# Altium project SFP_RFoF.PrjPcb (part 2 of 2)

## Sheet 08-RF_GPS.SchDoc
size C; SheetNumber: 8; SheetTotal: 12; SPICEModelCacheLBXRMXYW: <root> / <DocumentId>LBXRMXYW</DocumentId> / <CacheFrame Number="0"> / <Model Name="umk105bj104_v-f" Kind="CKT"> / <Text>* UMK105BJ104_V-F     SPICE MODEL  ( General Type ) / *-------------------------------------------------------------------------------------------------------- / * Model Generated by TAIYO YUDEN Corporation (http://www.ty-top.com) / * Version 1.0 / * TAIYO YUDEN Control No. 170508_120810 / * Copyright(c) 2012 TAIYO YUDEN CO.,LTD. All Rights Reserved. / *-------------------------------------------------------------------------------------------------------- / * / * Products Name : Multilayer Ceramic Capacitors / * / * Characteristics : / *     Capacitance : 0.1 uF , Rated Voltage : 50V , TCC : X5R / *     Case Size : 1.0 x 0.5 / 0.039 x 0.02 [mm/inch] , Thickness : 0.5 / 0.02 [mm/inch] / *     (Conditions: Temperature = 25 degC , DC Bias Current/Voltage = 0A / 0V) / * / * Frequency Range : 40Hz - 3GHz / * / * External Node Assignments : / * / *  1  o---| |---o  2 / * / *-------------------------------------------------------------------------------------------------------- / .SubCkt UMK105BJ104_V-F 1 2 / **************************** / C0 1 110 0.068998u / Cm 1 101 0.01292u / C1 101 102 0.041907u / Rc1 101 102 25.432k / C2 102 103 0.021417u / Rc2 102 103 1.1926k / C3 103 110 0.016759u / Rc3 103 110 12.415 / C2m 1 301 0.022631u / C21 301 302 0.1608u / Rc21 301 302 202.11k / C22 302 303 0.054305u / Rc22 302 303 87.274k / C23 303 304 0.14296u / Rc23 303 304 7.7387k / C24 304 305 0.08092u / Rc24 304 305 2.9339k / C25 305 306 0.04951u / Rc25 305 306 2.1733k / C26 306 307 0.043691u / Rc26 306 307 191.91 / C27 307 308 0.016759u / Rc27 307 308 147.23 / C28 308 309 5027.4p / Rc28 308 309 97.746 / C29 309 110 570.66p / Rc29 309 110 12.365 / Rp0 1 110 5G / L0 110 120 0.23341n / Lm 120 130 0.14222n / L1 120 121 0.036554n / RL1 121 130 1.698 / L2 120 122 0.11188n / RL2 122 130 0.33926 / L3 120 123 1.1401n / RL3 123 130 1.655 / CR 120 124 0.028892u / LR 124 125 0.10347n / RR 125 130 0.14446 / CL 130 140 2.048p / LL 130 140 0.1545n / RL 130 140 189.66 / Rs 140 2 26.069m / **************************** / .ends UMK105BJ104_V-F</Text> / </Model> / </CacheFrame> / </root>
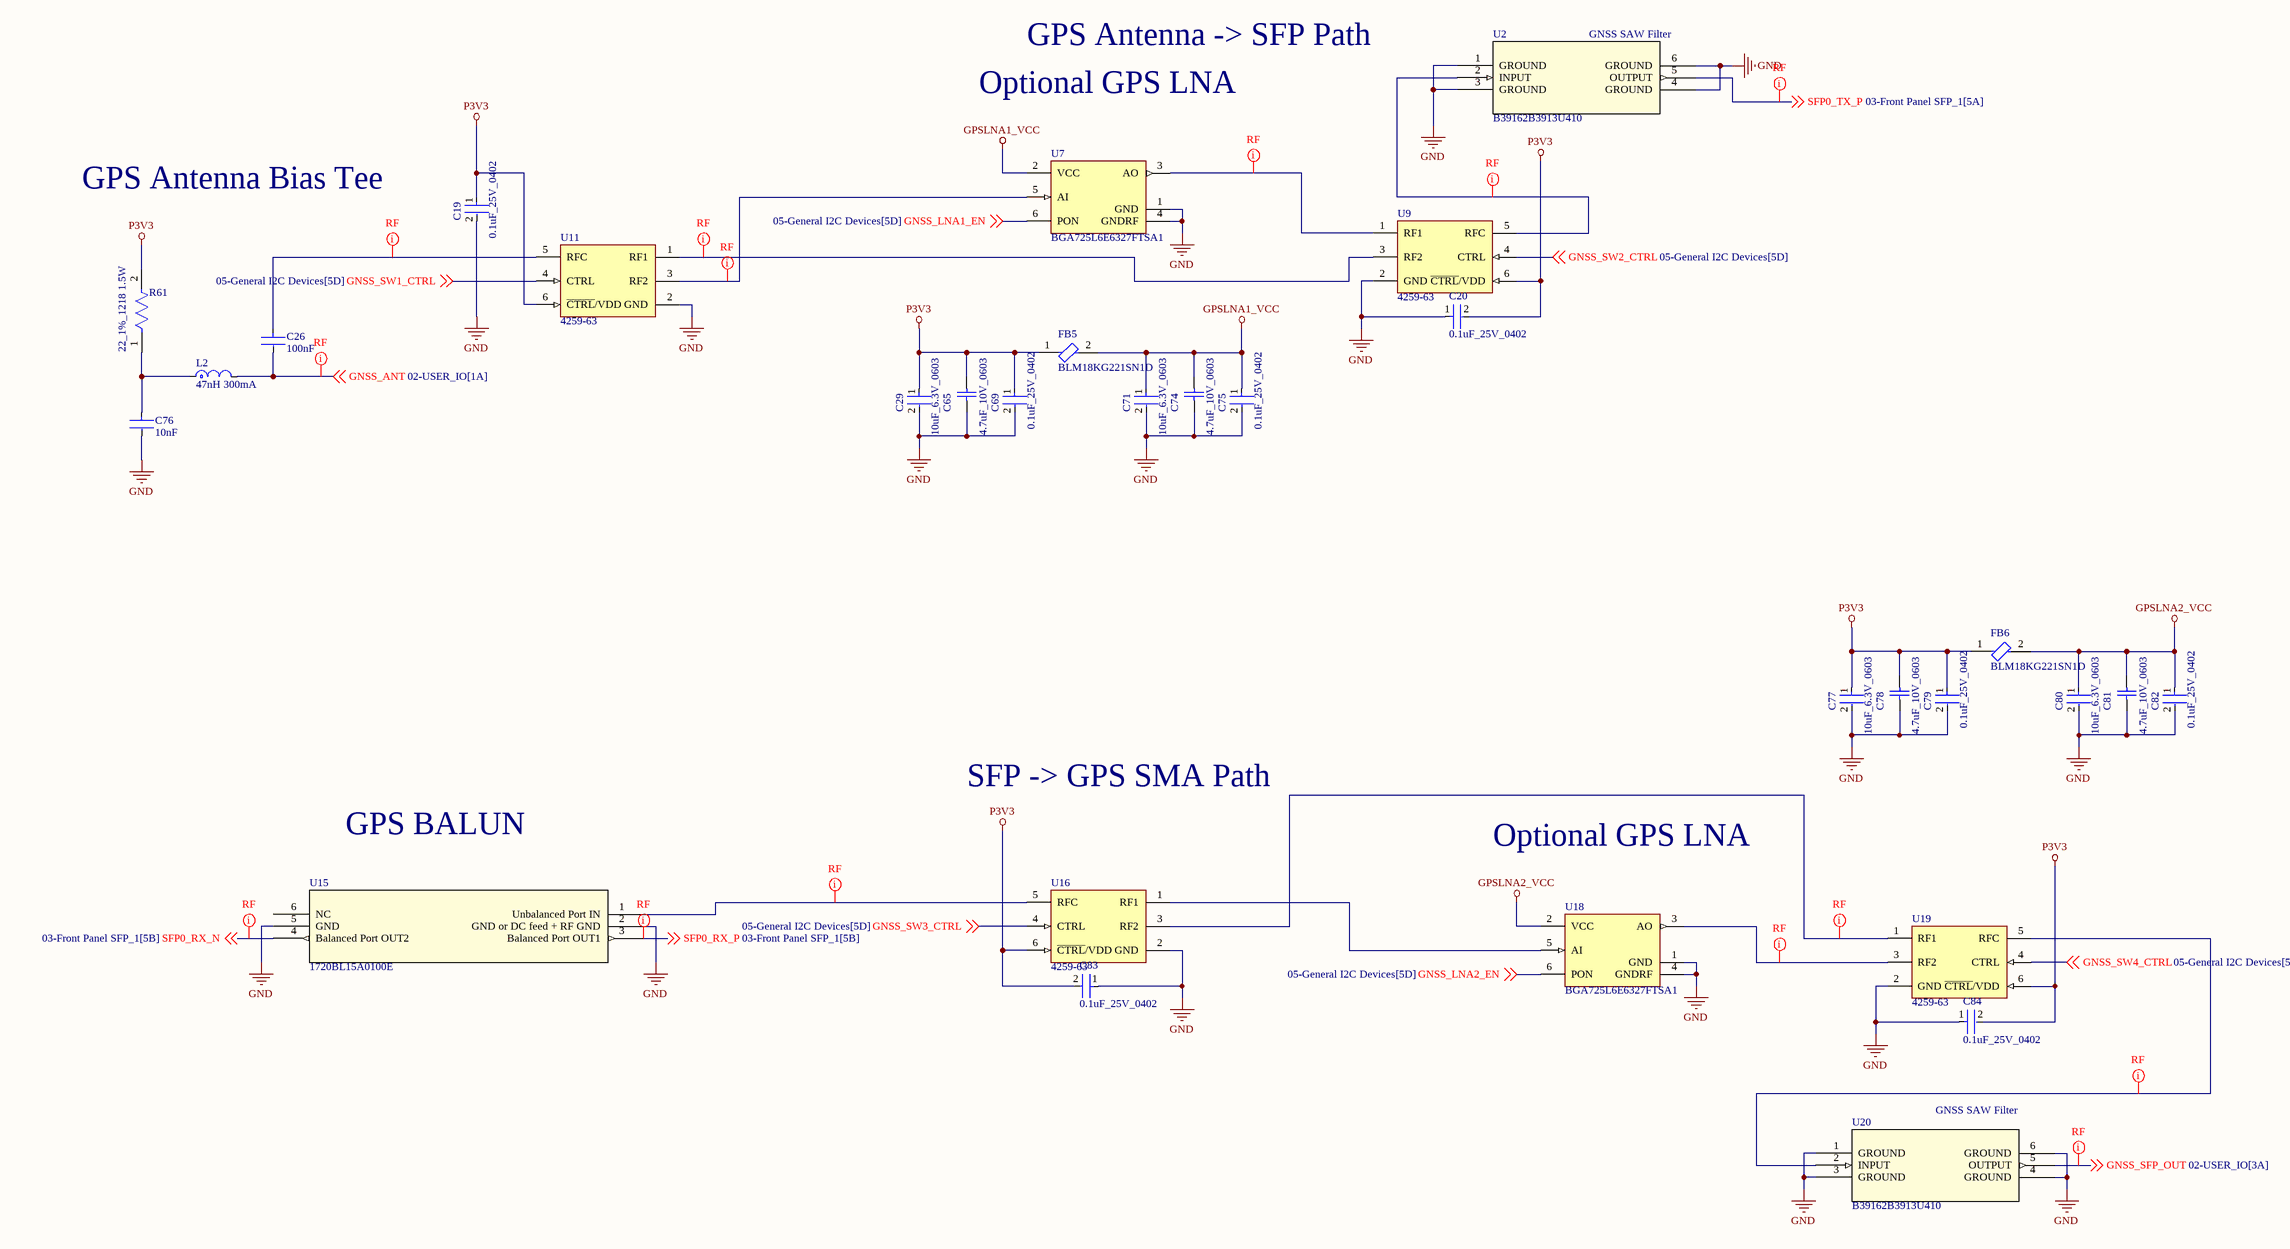
[diagram p5: 08-RF_GPS.SchDoc]

### Parts
C19  0.1uF_25V_0402  [FP-0402-L_1_0_1-W_0_5_0_1-IPC_C]
C20  0.1uF_25V_0402  [FP-0402-L_1_0_1-W_0_5_0_1-IPC_C]
C26  100nF  [FP-0402-L_1_0_0_05-W_0_5-IPC_B]
C29  10uF_6.3V_0603  [FP-C0603C106M9PACTU-MFG]
C65  4.7uF_10V_0603  [CAPC1608X87X35NL15T15]
C69  0.1uF_25V_0402  [FP-0402-L_1_0_1-W_0_5_0_1-IPC_C]
C71  10uF_6.3V_0603  [FP-C0603C106M9PACTU-MFG]
C74  4.7uF_10V_0603  [CAPC1608X87X35NL15T15]
C75  0.1uF_25V_0402  [FP-0402-L_1_0_1-W_0_5_0_1-IPC_C]
C76  10nF  [FP-GRM033-0_03-IPC_B]
C77  10uF_6.3V_0603  [FP-C0603C106M9PACTU-MFG]
C78  4.7uF_10V_0603  [CAPC1608X87X35NL15T15]
C79  0.1uF_25V_0402  [FP-0402-L_1_0_1-W_0_5_0_1-IPC_C]
C80  10uF_6.3V_0603  [FP-C0603C106M9PACTU-MFG]
C81  4.7uF_10V_0603  [CAPC1608X87X35NL15T15]
C82  0.1uF_25V_0402  [FP-0402-L_1_0_1-W_0_5_0_1-IPC_C]
C83  0.1uF_25V_0402  [FP-0402-L_1_0_1-W_0_5_0_1-IPC_C]
C84  0.1uF_25V_0402  [FP-0402-L_1_0_1-W_0_5_0_1-IPC_C]
FB5  BLM18KG221SN1D  [FP-BLM18-0_15-t0_8-IPC_B]
FB6  BLM18KG221SN1D  [FP-BLM18-0_15-t0_8-IPC_B]
L2  47nH 300mA  [FP-LQG15HH_02-IPC_B]
R61  22_1%_1218 1.5W  [FP-CRCW1218-HPe3-MFG]
U2  B39162B3913U410  [B39162B3913U410_QUA]
U7  BGA725L6E6327FTSA1  [FP-PG-TSLP-6-MFG]
U9  4259-63  [PERE-SC-70-6_M]
U11  4259-63  [PERE-SC-70-6_M]
U15  1720BL15A0100E  [SMT_15B0050E_JOT]
U16  4259-63  [PERE-SC-70-6_M]
U18  BGA725L6E6327FTSA1  [FP-PG-TSLP-6-MFG]
U19  4259-63  [PERE-SC-70-6_M]
U20  B39162B3913U410  [B39162B3913U410_QUA]

### Nets
GND: C19.2 C20.1 C29.2 C65.1 C69.2 C71.2 C74.1 C75.2 C76.2 C77.2 C78.1 C79.2 C80.2 C81.1 C82.2 C83.1 C84.1 U2.1(GROUND) U2.3(GROUND) U2.4(GROUND) U2.6(GROUND) U7.1(GND) U7.4(GNDRF) U9.2(GND) U11.2(GND) U15.2(GND_or_DC_feed_+_RF_GND) U15.5(GND) U16.2(GND) U18.1(GND) U18.4(GNDRF) U19.2(GND) U20.1(GROUND) U20.3(GROUND) U20.4(GROUND) U20.6(GROUND)
GPSLNA1_VCC: C71.1 C74.2 C75.1 FB5.2 U7.2(VCC)
GPSLNA2_VCC: C80.1 C81.2 C82.1 FB6.2 U18.2(VCC)
P3V3: C19.1 C20.2 C29.1 C65.2 C69.1 C77.1 C78.2 C79.1 C83.2 C84.2 FB5.1 FB6.1 R61.2 U9.6(~{CTRL}/VDD) U11.6(~{CTRL}/VDD) U16.6(~{CTRL}/VDD) U19.6(~{CTRL}/VDD)
GNSS_ANT: C26.2 L2.2 ; off-sheet GNSS_ANT
GNSS_LNA1_EN: U7.6(PON) ; off-sheet GNSS_LNA1_EN
GNSS_LNA2_EN: U18.6(PON) ; off-sheet GNSS_LNA2_EN
GNSS_SFP_OUT: U20.5(OUTPUT) ; off-sheet GNSS_SFP_OUT
GNSS_SW1_CTRL: U11.4(CTRL) ; off-sheet GNSS_SW1_CTRL
GNSS_SW2_CTRL: U9.4(CTRL) ; off-sheet GNSS_SW2_CTRL
GNSS_SW3_CTRL: U16.4(CTRL) ; off-sheet GNSS_SW3_CTRL
GNSS_SW4_CTRL: U19.4(CTRL) ; off-sheet GNSS_SW4_CTRL
SFP0_RX_N: U15.4(Balanced_Port_OUT2) ; off-sheet SFP0_RX_N
SFP0_RX_P: U15.3(Balanced_Port_OUT1) ; off-sheet SFP0_RX_P
SFP0_TX_P: U2.5(OUTPUT) ; off-sheet SFP0_TX_P
NetC26_1: C26.1 U11.5(RFC)
NetC76_1: C76.1 L2.1 R61.1
NetU2_2: U2.2(INPUT) U9.5(RFC)
NetU7_3: U7.3(AO) U9.1(RF1)
NetU7_5: U7.5(AI) U11.3(RF2)
NetU9_3: U9.3(RF2) U11.1(RF1)
NetU15_1: U15.1(Unbalanced_Port_IN) U16.5(RFC)
NetU16_1: U16.1(RF1) U18.5(AI)
NetU16_3: U16.3(RF2) U19.1(RF1)
NetU18_3: U18.3(AO) U19.3(RF2)
NetU19_5: U19.5(RFC) U20.2(INPUT)

Not connected (* = marked no-connect by the designer): U15 6(NC)

### Layout directives
net class RF: GNSS_ANT, GNSS_SFP_OUT, NetC26_1, NetU2_2, NetU7_3, NetU7_5, NetU9_3, NetU15_1, NetU16_3, NetU18_3, NetU19_5, SFP0_RX_N, SFP0_RX_P, SFP0_TX_P

### Notes on the sheet
- GPS Antenna -> SFP Path
- (near U2) GNSS SAW Filter
- Optional GPS LNA
- GPS Antenna Bias Tee
- GPS BALUN
- SFP -> GPS SMA Path
- (near U20) GNSS SAW Filter

### Library data of the parts
C19 C20 C69 C75 C79 C82-C84 = CMP-2008-02519-2: General Purpose Ceramic Capacitor, 0402, 100nF, 10%, X7R, 15%, 25V; Package Quantity: 1; Capacitance: 100nF; Min Operating Temperature: -55°C; Voltage: 25V; Voltage Rating: 25V; Construction: Flat; Max Operating Temperature: 125°C; Radiation Hardening: No; Depth: 0.5mm; Thickness: 0.022inch; Voltage Rating (DC): 25V; Number of Pins: 2; Lead Free: Lead Free; Series: -; REACH SVHC: No SVHC; Length: 1mm; Dielectric: X7R; RoHS Compliant: Yes; Mount: Surface Mount; Packaging: Tape and Reel; Case/Package: 0402; Case Code (Imperial): 0402; Termination: SMD/SMT; Width: 0.02inch; Case Code (Metric): 1005; Tolerance: 10%
C26 = CMP-14477-000330-2: None; Voltage Rating (DC): 50V; Dielectric: X5R; Tolerance: 10%; RoHS Compliant: Yes; Termination: SMD/SMT; Packaging: Tape and Reel; Capacitance: 100nF; Height: 0.5mm; Halogen Free: Halogen Free; Case Code (Metric): 1005; Width: 0.02inch; Max Operating Temperature: 85°C; Voltage Rating: 50V; Min Operating Temperature: -55°C; Package Quantity: 10000; Case/Package: 0402; Case Code (Imperial): 0402; Length: 0.039inch; Thickness: 0.022inch; Mount: Surface Mount
C29 C71 C77 C80 = CMP-2006-02285-3: CAP CER 10UF 6.3V X5R 0603; Manufacturer Part Number: C0603C106M9PACTU; Manufacturer: Kemet; Material: Ceramic; Temperature Coefficient: 15%; Tolerance: 20%; Category: Cap; Height: 0.9mm; Digikey Description: CAP CER 10UF 6.3V X5R 0603; Mouser Description: In a Pack of 10, KEMET 0603 (1608M) 10µF MLCC 6.3V dc ±20% SMD C0603C106M9PACTU; Voltage Rating: 6.3V; Device Class L2: Capacitors; Temperature Range Low: -55°C; Temperature Characteristic: X5R; ComponentLink2Description: Datasheet; Ipc Land Pattern Name: CAPC16080X80; ComponentLink2URL: http://www.kemet.com/Lists/ProductCatalog/Attachments/19/KEM_C1006_X5R_SMD.pdf; Capacitance: 10uF; Temperature Range High: +85°C; Device Class L3: Ceramic Capacitors; RoHS: TRUE; Automotive: No; Value: 10uF; Temperature: -55°C to +85°C; Device Class L1: Passive Components; Package: C0603C106M9PACTU; Lead Free: Yes; Octopart: https://octopart.com/c0603c106m9pactu-kemet-8375727
C65 C74 C78 C81 = CMP-2006-03238-1: Part Number: C0603C475K8PACTU; Manufacturer: Kemet
C76 = CMP-06035-000448-1: Chip Multilayer Ceramic Capacitors for General Purpose, 0201, 10000pF, X7R, 15%, 10%, 16V; Width: 300um; Tolerance: 10%; Capacitance: 10nF; Thickness: 300um; Dielectric: X7R; Voltage Rating (DC): 16V; Length: 600um
FB5 FB6 = CMP-0686-00556-7: Chip Ferrite Bead, 0603, 220Ω @ 100MHz, 0.05Ω, 25%, 2.2A; DC Resistance (DCR): 50mR; Number of Circuits: 1; Impedance: 220R; Current Rating: 2.2A; Material: Ferrite; Test Frequency: 100MHz; Depth: 0.8mm; Series: BLM18K; RoHS Compliant: Yes; Termination: SMD/SMT; Max Current Rating: 2.2A; Case Code (Metric): 1608; Radiation Hardening: No; Number of Pins: 2; Length: 1.6mm; Lead Free: Lead Free; Package Quantity: 1; Height: 0.8mm; Core Material: Ferrite; Inductor Type: FERRITE BEAD; Min Operating Temperature: -55°C; Case/Package: 0603; Case Code (Imperial): 0603; Number of Lines: 1; Packaging: Tape and Reel; REACH SVHC: No SVHC; Max Operating Temperature: 125°C; Military Standard: Not; DC Resistance-Max: 50mR; Width: 0.8mm; DC Current: 2.2A; Max DC Current: 2.2A; Tolerance: 25%; Weight: 7.1E-05oz
L2 = CMP-06042-015783-1: Multilayer type RF Inductor 47nH ±5% 0.72Ω 300mA 0402; Core Material: Air; DC Resistance (DCR): 720mR; DC Current: 200mA; Shielding: Unshielded; Self Resonant Frequency: 1GHz; Q Factor: 8; Test Frequency: 100MHz; Tolerance: 5%; Packaging: Tape and Reel; Case Code (Imperial): 0402; Max Operating Temperature: 125°C; Military Standard: Not; Length: 1mm; Radiation Hardening: No; Height: 0.5mm; Min Operating Temperature: -55°C; Width: 0.02inch; Inductance: 47nH; Lead Free: Lead Free; Termination: SMD/SMT; Height - Seated (Max): 0.022inch; Rated Current-Max: 200mA; Case/Package: 0402; Max DC Current: 200mA; Series: LQG15HS; Case Code (Metric): 1005; Mount: Surface Mount; Current Rating: 200mA; Depth: 0.55mm; Package Quantity: 1
R61 = CMP-02407-011337-1: RES Thick Film, 22.6Ω, 1%, 1.5W, 100ppm/°C, 1218; Resistance: 22.6R; Temperature Coefficient: 100ppm/°C; Min Operating Temperature: -55°C; Number of Terminations: 2; Length: 0.122inch; Max Operating Temperature: 155°C; Packaging: Tape and Reel; Case/Package: 1218; Height: 0.028inch; RoHS Compliant: Yes; Tolerance: 1%; Width: 0.181inch; Package Quantity: 4000; Resistor Type: Thick Film; Features: Automotive AEC-Q200; Lead Free: Lead Free; Max Power Dissipation: 1.5W
U2 U20 = B39162B3913U410: No Description Available; Mfr_Name: Qualcomm; RefDes: RefDes; Type: Type
U7 U18 = CMP-32860-000003-1: IC AMP GPS 1.55-1.615GHZ TSLP6-2; Manufacturer: Infineon; Max Power Dissipation: 72mW; Noise Figure: 0.65dB; Gain: 20dB; Max Junction Temp: +150°C; Nominal Supply Current: 3.6mA; Max Supply Voltage: 3.6V; Min Supply Voltage: 1.5V; Max Frequency: 1615MHz; Bandwidth: 65MHz; RoHS: TRUE; Device Class L1: Integrated Circuits (ICs); Manufacturer Part Number: BGA725L6E6327FTSA1; Octopart: https://octopart.com/bga725l6e6327ftsa1-infineon-23421878; Temperature Range High: +150°C; Temperature: to +150°C; ComponentLink2URL: https://www.infineon.com/dgdl/Infineon-BGA725L6-DS-v02_00-en.pdf?fileId=db3a30433784a0400137ef9a4d341f23; Device Class L2: RF Semiconductors and Devices; Ambient Temperature Range Low: -40°C; Device Class L3: RF Amplifiers; ComponentLink2Description: Datasheet; Mouser Description: RF Amp Chip Single Low Noise Amplifier 1615MHz 3.6V 6-Pin TSLP T/R; Digikey Description: IC AMP GPS 1.55-1.615GHZ TSLP6-2; Package: PG-TSLP-6; Ambient Temperature Range High: +85°C; Footprint Url: https://www.infineon.com/cms/en/product/packages/PG-TSLP/PG-TSLP-6-2/; Category: IC; Lead Free: Yes; Height: 0.4mm; Automotive: No
U9 U11 U16 U19 = CMP-2000-05298-1: IC RF Switch SPDT, 50 Ohm, 6-Pin SC70, RoHS, Tape and Reel; Manufacturer: Peregrine Semiconductor; P1dB: 29dBm(typ)IP1dB; Topology: Reflective; Frequency - Upper: 3GHz; Insertion Loss @ Frequency: 0.5dB@2GHz; IIP3: 55dBm(typ); Voltage - Supply: 1.8V~3.3V; Other Names: 1046-1011-24259-63-ND425963PE4259PE4259SCBC-ZPE4259SCBC-Z-ND; Isolation @ Frequency: 20dB@2GHz(typ); Frequency - Lower: 10MHz; Online Catalog: PE4259; Impedance: 50Ohm; RF Type: GeneralPurpose; Series: UltraCMOS; Manufacturer URL: http://www.psemi.com/; Package Description: 6-Pin Small Outline Transistor, Body 2.05 x 1.25 mm, Pitch 0.65 mm; Family: RFSwitches; Packaging: Tape&Reel(TR); Features: Single/DualLineControl; Package / Case: 6-TSSOP,SC-88,SOT-363; Operating Temperature: -40degC~85degC; Circuit: SPDT; Supplier Device Package: SC-70-6; Standard Package: 3,000; Datasheet URL: https://datasheet.ciiva.com/15100/getdatasheetpartid-685660-15100501.pdf; Category: RF/IFandRFID; Datasheet Version: Jan-11; Package Reference: SC-70-6
U15 = 1720BL15A0100E: No Description Available; Mfr_Name: Johanson Technology; RefDes: RefDes; Type: Type

## Sheet 09-RF_SUBG.SchDoc
size C; SheetNumber: 9; SheetTotal: 12; SPICEModelCacheYEUHMWUF: <root> / <DocumentId>YEUHMWUF</DocumentId> / <CacheFrame Number="0"> / <Model Name="umk105bj104_v-f" Kind="CKT"> / <Text>* UMK105BJ104_V-F     SPICE MODEL  ( General Type ) / *-------------------------------------------------------------------------------------------------------- / * Model Generated by TAIYO YUDEN Corporation (http://www.ty-top.com) / * Version 1.0 / * TAIYO YUDEN Control No. 170508_120810 / * Copyright(c) 2012 TAIYO YUDEN CO.,LTD. All Rights Reserved. / *-------------------------------------------------------------------------------------------------------- / * / * Products Name : Multilayer Ceramic Capacitors / * / * Characteristics : / *     Capacitance : 0.1 uF , Rated Voltage : 50V , TCC : X5R / *     Case Size : 1.0 x 0.5 / 0.039 x 0.02 [mm/inch] , Thickness : 0.5 / 0.02 [mm/inch] / *     (Conditions: Temperature = 25 degC , DC Bias Current/Voltage = 0A / 0V) / * / * Frequency Range : 40Hz - 3GHz / * / * External Node Assignments : / * / *  1  o---| |---o  2 / * / *-------------------------------------------------------------------------------------------------------- / .SubCkt UMK105BJ104_V-F 1 2 / **************************** / C0 1 110 0.068998u / Cm 1 101 0.01292u / C1 101 102 0.041907u / Rc1 101 102 25.432k / C2 102 103 0.021417u / Rc2 102 103 1.1926k / C3 103 110 0.016759u / Rc3 103 110 12.415 / C2m 1 301 0.022631u / C21 301 302 0.1608u / Rc21 301 302 202.11k / C22 302 303 0.054305u / Rc22 302 303 87.274k / C23 303 304 0.14296u / Rc23 303 304 7.7387k / C24 304 305 0.08092u / Rc24 304 305 2.9339k / C25 305 306 0.04951u / Rc25 305 306 2.1733k / C26 306 307 0.043691u / Rc26 306 307 191.91 / C27 307 308 0.016759u / Rc27 307 308 147.23 / C28 308 309 5027.4p / Rc28 308 309 97.746 / C29 309 110 570.66p / Rc29 309 110 12.365 / Rp0 1 110 5G / L0 110 120 0.23341n / Lm 120 130 0.14222n / L1 120 121 0.036554n / RL1 121 130 1.698 / L2 120 122 0.11188n / RL2 122 130 0.33926 / L3 120 123 1.1401n / RL3 123 130 1.655 / CR 120 124 0.028892u / LR 124 125 0.10347n / RR 125 130 0.14446 / CL 130 140 2.048p / LL 130 140 0.1545n / RL 130 140 189.66 / Rs 140 2 26.069m / **************************** / .ends UMK105BJ104_V-F</Text> / </Model> / </CacheFrame> / </root>
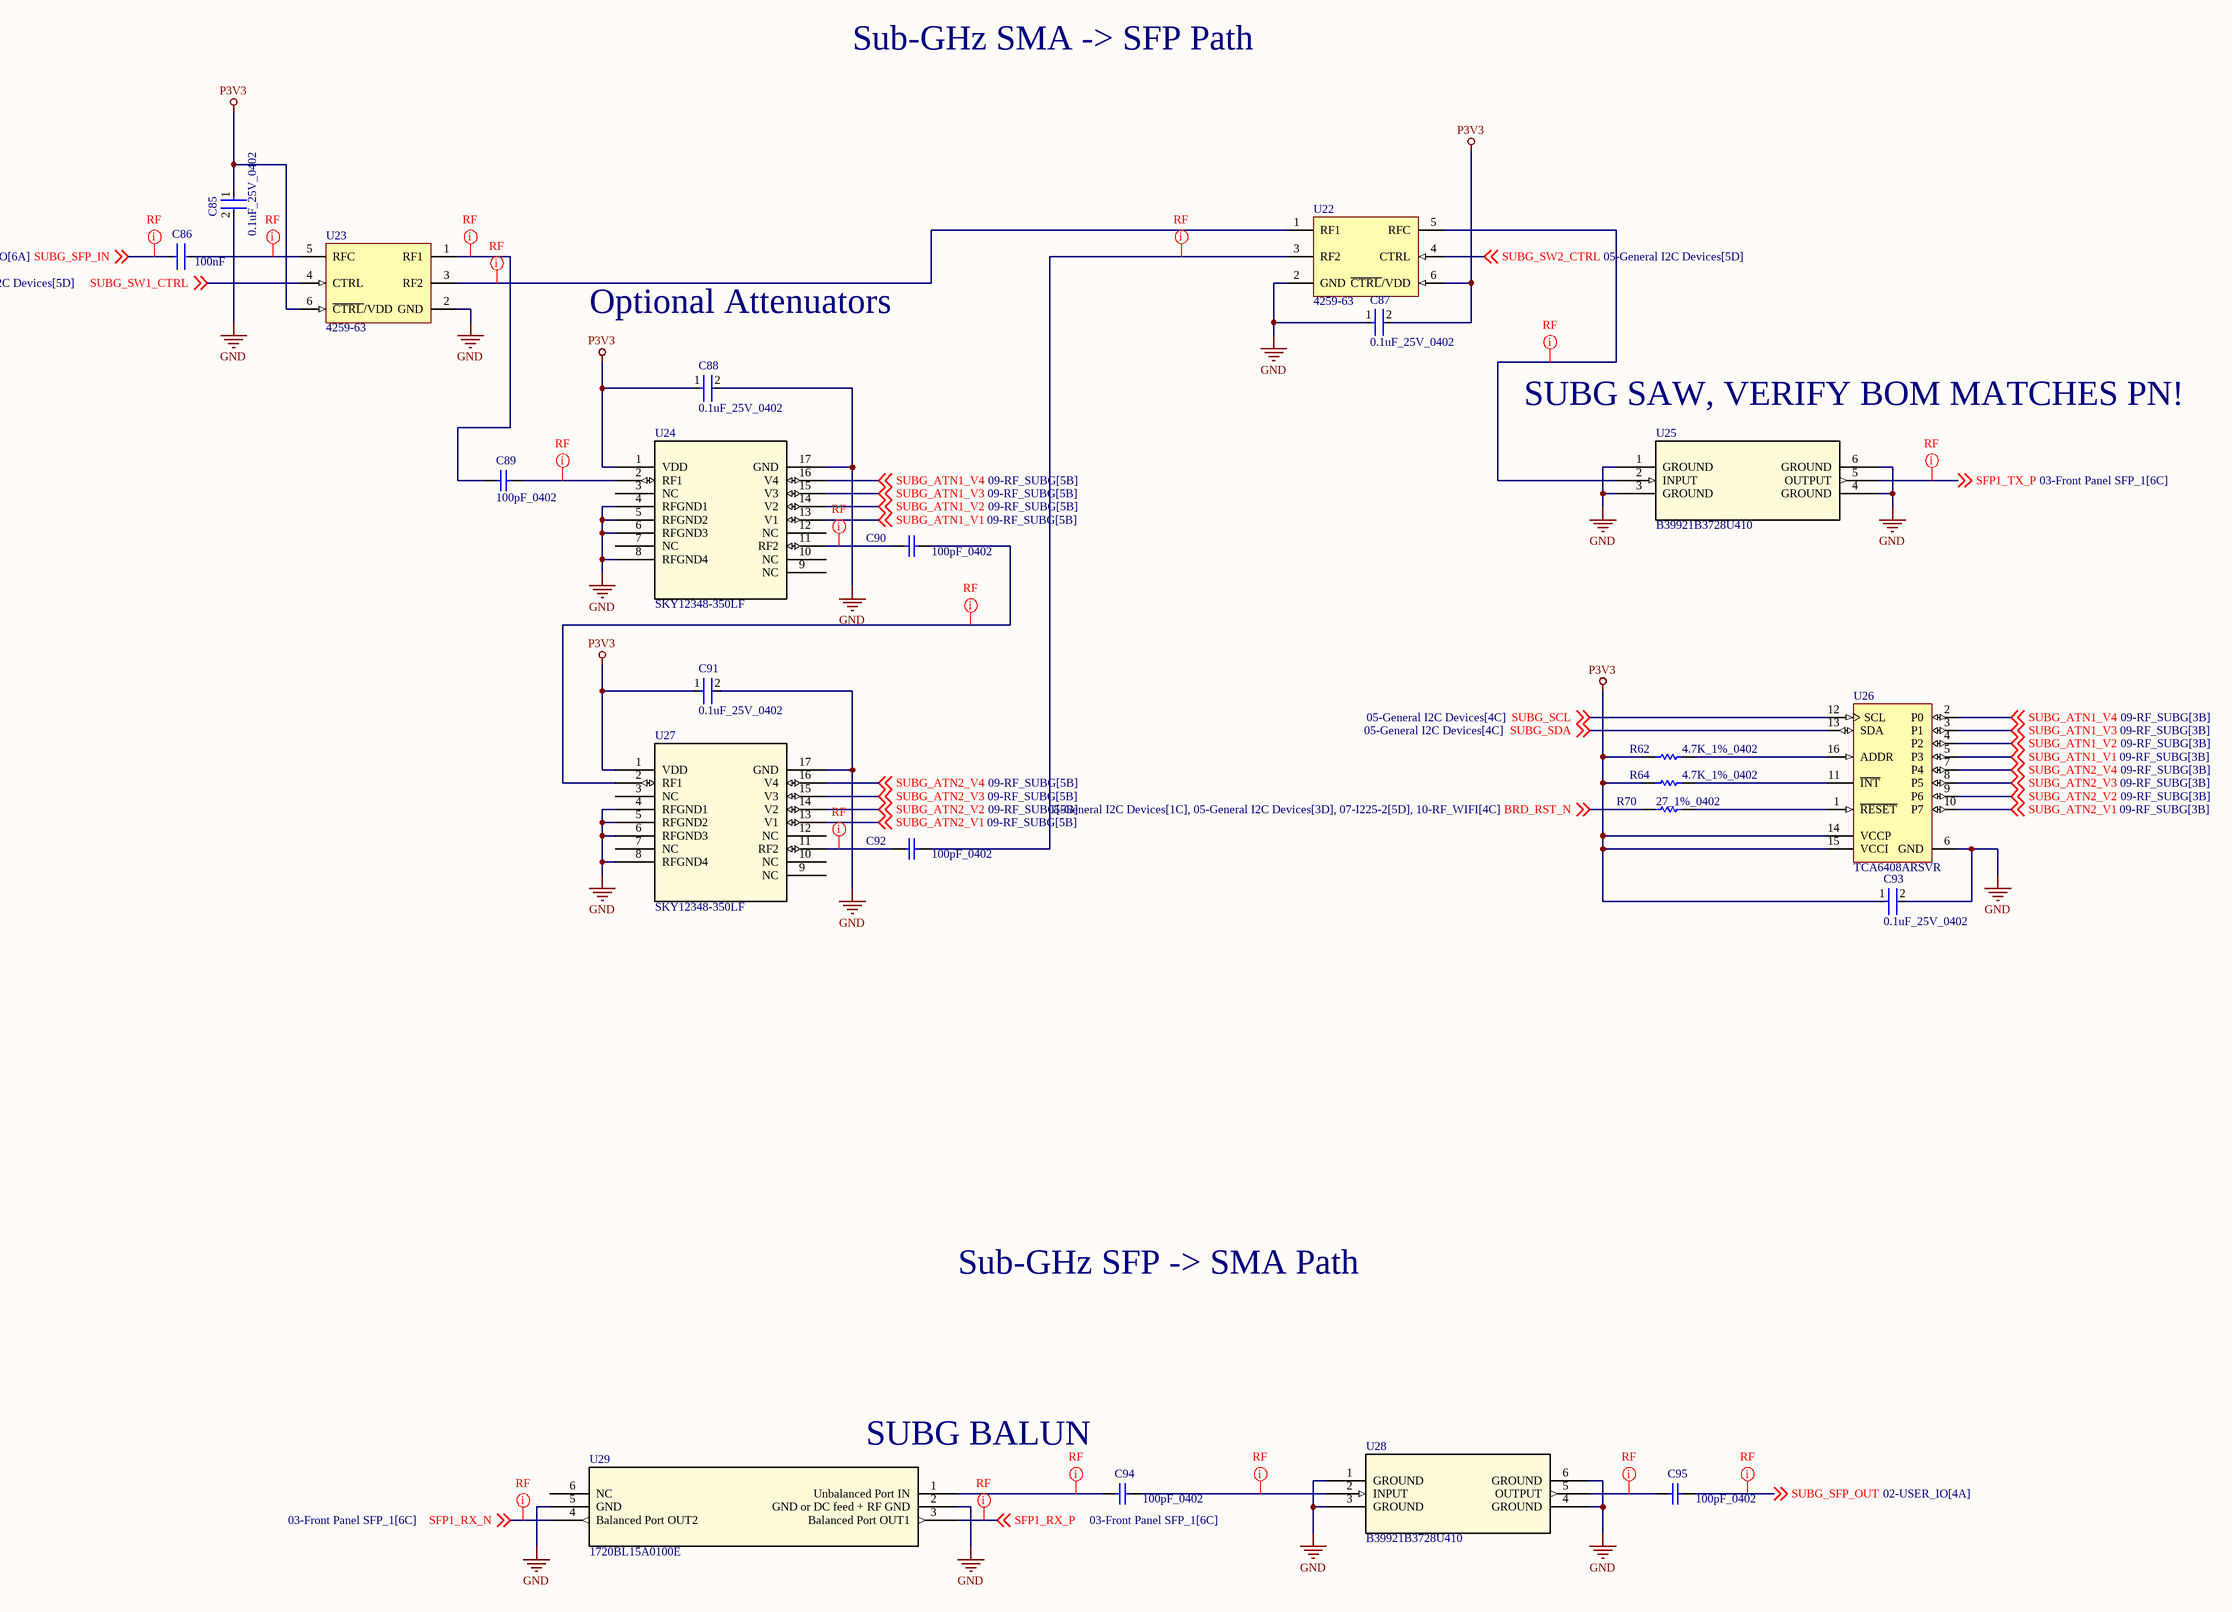
[diagram p6: 09-RF_SUBG.SchDoc]

### Parts
C85  0.1uF_25V_0402  [FP-0402-L_1_0_1-W_0_5_0_1-IPC_C]
C86  100nF  [FP-0402-L_1_0_0_05-W_0_5-IPC_B]
C87  0.1uF_25V_0402  [FP-0402-L_1_0_1-W_0_5_0_1-IPC_C]
C88  0.1uF_25V_0402  [FP-0402-L_1_0_1-W_0_5_0_1-IPC_C]
C89  100pF_0402  [CAPC1005X55X25ML05T10]
C90  100pF_0402  [CAPC1005X55X25ML05T10]
C91  0.1uF_25V_0402  [FP-0402-L_1_0_1-W_0_5_0_1-IPC_C]
C92  100pF_0402  [CAPC1005X55X25ML05T10]
C93  0.1uF_25V_0402  [FP-0402-L_1_0_1-W_0_5_0_1-IPC_C]
C94  100pF_0402  [CAPC1005X55X25ML05T10]
C95  100pF_0402  [CAPC1005X55X25ML05T10]
R62  4.7K_1%_0402  [RESC1005X40X25NL10T10]
R64  4.7K_1%_0402  [RESC1005X40X25NL10T10]
R70  27_1%_0402  [RESC1005X40X25NL05T05]
U22  4259-63  [PERE-SC-70-6_M]
U23  4259-63  [PERE-SC-70-6_M]
U24  SKY12348-350LF  [SKY12348-350LF_SKY]
U25  B39921B3728U410  [B39162B3913U410_QUA]
U26  TCA6408ARSVR  [RSV0016A_V]
U27  SKY12348-350LF  [SKY12348-350LF_SKY]
U28  B39921B3728U410  [B39162B3913U410_QUA]
U29  1720BL15A0100E  [SMT_15B0050E_JOT]

### Nets
GND: C85.2 C87.1 C88.2 C91.2 C93.2 U22.2(GND) U23.2(GND) U24.4(RFGND1) U24.5(RFGND2) U24.6(RFGND3) U24.8(RFGND4) U24.17(GND) U25.1(GROUND) U25.3(GROUND) U25.4(GROUND) U25.6(GROUND) U26.6(GND) U27.4(RFGND1) U27.5(RFGND2) U27.6(RFGND3) U27.8(RFGND4) U27.17(GND) U28.1(GROUND) U28.3(GROUND) U28.4(GROUND) U28.6(GROUND) U29.2(GND_or_DC_feed_+_RF_GND) U29.5(GND)
P3V3: C85.1 C87.2 C88.1 C91.1 C93.1 R62.2 R64.2 U22.6(~{CTRL}/VDD) U23.6(~{CTRL}/VDD) U24.1(VDD) U26.14(VCCP) U26.15(VCCI) U27.1(VDD)
BRD_RST_N: R70.1 ; off-sheet BRD_RST_N
SFP1_RX_N: U29.4(Balanced_Port_OUT2) ; off-sheet SFP1_RX_N
SFP1_RX_P: U29.3(Balanced_Port_OUT1) ; off-sheet SFP1_RX_P
SFP1_TX_P: U25.5(OUTPUT) ; off-sheet SFP1_TX_P
SUBG_ATN1_V1: U24.13(V1) U26.5(P3) ; off-sheet SUBG_ATN1_V1
SUBG_ATN1_V2: U24.14(V2) U26.4(P2) ; off-sheet SUBG_ATN1_V2
SUBG_ATN1_V3: U24.15(V3) U26.3(P1) ; off-sheet SUBG_ATN1_V3
SUBG_ATN1_V4: U24.16(V4) U26.2(P0) ; off-sheet SUBG_ATN1_V4
SUBG_ATN2_V1: U26.10(P7) U27.13(V1) ; off-sheet SUBG_ATN2_V1
SUBG_ATN2_V2: U26.9(P6) U27.14(V2) ; off-sheet SUBG_ATN2_V2
SUBG_ATN2_V3: U26.8(P5) U27.15(V3) ; off-sheet SUBG_ATN2_V3
SUBG_ATN2_V4: U26.7(P4) U27.16(V4) ; off-sheet SUBG_ATN2_V4
SUBG_SCL: U26.12(SCL) ; off-sheet SUBG_SCL
SUBG_SDA: U26.13(SDA) ; off-sheet SUBG_SDA
SUBG_SFP_IN: C86.1 ; off-sheet SUBG_SFP_IN
SUBG_SFP_OUT: C95.2 ; off-sheet SUBG_SFP_OUT
SUBG_SW1_CTRL: U23.4(CTRL) ; off-sheet SUBG_SW1_CTRL
SUBG_SW2_CTRL: U22.4(CTRL) ; off-sheet SUBG_SW2_CTRL
NetC86_2: C86.2 U23.5(RFC)
NetC89_1: C89.1 U23.1(RF1)
NetC89_2: C89.2 U24.2(RF1)
NetC90_1: C90.1 U24.11(RF2)
NetC90_2: C90.2 U27.2(RF1)
NetC92_1: C92.1 U27.11(RF2)
NetC92_2: C92.2 U22.3(RF2)
NetC94_1: C94.1 U29.1(Unbalanced_Port_IN)
NetC94_2: C94.2 U28.2(INPUT)
NetC95_1: C95.1 U28.5(OUTPUT)
NetR62_1: R62.1 U26.16(ADDR)
NetR64_1: R64.1 U26.11(~{INT})
NetR70_2: R70.2 U26.1(~{RESET})
NetU22_1: U22.1(RF1) U23.3(RF2)
NetU22_5: U22.5(RFC) U25.2(INPUT)

Not connected (* = marked no-connect by the designer): U24 3(NC) 7(NC) 9(NC) 10(NC) 12(NC); U27 3(NC) 7(NC) 9(NC) 10(NC) 12(NC); U29 6(NC)

### Layout directives
net class RF: NetC86_2, NetC89_1, NetC89_2, NetC90_1, NetC90_2, NetC92_1, NetC92_2, NetC94_1, NetC94_2, NetC95_1, NetU22_1, NetU22_5, SFP1_RX_N, SFP1_RX_P, SFP1_TX_P, SUBG_SFP_IN, SUBG_SFP_OUT

### Notes on the sheet
- Sub-GHz SMA -> SFP Path
- Optional Attenuators
- SUBG SAW, VERIFY BOM MATCHES PN!
- Sub-GHz SFP -> SMA Path
- (near U29) SUBG BALUN

### Library data of the parts
C85 C87 C88 C91 C93 = CMP-2008-02519-2: as C19 on sheet 08-RF_GPS; Package Quantity: 1; Capacitance: 100nF; Min Operating Temperature: -55°C; Voltage: 25V; Voltage Rating: 25V; Construction: Flat; Max Operating Temperature: 125°C; Radiation Hardening: No; Depth: 0.5mm; Thickness: 0.022inch; Voltage Rating (DC): 25V; Number of Pins: 2; Lead Free: Lead Free; Series: -; REACH SVHC: No SVHC; Length: 1mm; Dielectric: X7R; RoHS Compliant: Yes; Mount: Surface Mount; Packaging: Tape and Reel; Case/Package: 0402; Case Code (Imperial): 0402; Termination: SMD/SMT; Width: 0.02inch; Case Code (Metric): 1005; Tolerance: 10%
C86 = CMP-14477-000330-2: as C26 on sheet 08-RF_GPS; RoHS Compliant: Yes; Termination: SMD/SMT; Packaging: Tape and Reel; Capacitance: 100nF; Height: 0.5mm; Halogen Free: Halogen Free; Case Code (Metric): 1005; Width: 0.02inch; Max Operating Temperature: 85°C; Voltage Rating: 50V; Min Operating Temperature: -55°C; Package Quantity: 10000; Case/Package: 0402; Case Code (Imperial): 0402; Length: 0.039inch; Thickness: 0.022inch; Mount: Surface Mount
C89 C90 C92 C94 C95 = CMP-2008-03915-1: Manufacturer: Murata; Part Number: GRM1555C1H101JA01D
R62 R64 = CMP-2002-05217-1: Manufacturer: Bourns; Part Number: CR0402-FX-4701GLF
R70 = CMP-2002-08434-1: Part Number: CRCW040227R0FKED; Manufacturer: Vishay Dale
U22 U23 = CMP-2000-05298-1: as U9 on sheet 08-RF_GPS; Series: UltraCMOS; Manufacturer URL: http://www.psemi.com/; Package Description: 6-Pin Small Outline Transistor, Body 2.05 x 1.25 mm, Pitch 0.65 mm; Family: RFSwitches; Packaging: Tape&Reel(TR); Features: Single/DualLineControl; Package / Case: 6-TSSOP,SC-88,SOT-363; Operating Temperature: -40degC~85degC; Circuit: SPDT; Supplier Device Package: SC-70-6; Standard Package: 3,000; Datasheet URL: https://datasheet.ciiva.com/15100/getdatasheetpartid-685660-15100501.pdf; Category: RF/IFandRFID; Datasheet Version: Jan-11; Package Reference: SC-70-6
U24 U27 = SKY12348-350LF: No Description Available; Mfr_Name: Skyworks; RefDes: RefDes; Type: Type
U25 U28 = B39162B3913U410: as U2 on sheet 08-RF_GPS; RefDes: RefDes; Type: Type
U26 = CMP-0314-00021-2: Low-Voltage 8-Bit I2C and SMBus I/O Expander, 1.65 to 5.5 V, -40 to 85 degC, 16-pin UQFN (RSV), Green (RoHS & no Sb/Br); Manufacturer: Texas Instruments; Configuration Registers: Yes; Max Frequency(kHz): 400; # of I/Os: 8; SubFamily: I2C IO Expander; I2C Address: 0100 00x; VCC(Min)(V): 1.65; VCC(Max)(V): 5.5; Reset Input: Yes; ComponentLink2URL: http://www.ti.com/litv/pdf/mpqf115g; PackageVersion: revD, Dec-2011; No. of Outputs: 8; PackageReference: RSV0016A; DatasheetVersion: SCPS192C; fSCLK(Max)(MHz): 400; Mounting Technology: Surface Mount; ComponentLink1Description: Datasheet; Push-Pull I/O Type: Yes; Code_JEDEC: MO-288*; PackageDescription: 16-Leads Plastic Quad Flatpack No-Lead, 2.6 x 1.8 x 0.5 mm Body, 0.4 mm Pitch; ComponentLink1URL: http://www.ti.com/general/docs/lit/getliterature.tsp?genericPartNumber=TCA6408A&fileType=pdf; Interrupt Output: Yes; PartNumber: TCA6408ARSVR; Eco-Plan: Green (RoHS & no Sb/Br); Low Power: Yes; Vcc range(V): 1.65 to 5.5; ComponentLink2Description: Package Specification; 5V Tolerant I/O: Yes
U29 = 1720BL15A0100E: as U15 on sheet 08-RF_GPS; RefDes: RefDes; Type: Type

## Sheet 10-RF_WIFI.SchDoc
size C; SheetNumber: 10; SheetTotal: 12; SPICEModelCacheVJLQFKRM: <root> / <DocumentId>VJLQFKRM</DocumentId> / <CacheFrame Number="0"> / <Model Name="umk105bj104_v-f" Kind="CKT"> / <Text>* UMK105BJ104_V-F     SPICE MODEL  ( General Type ) / *-------------------------------------------------------------------------------------------------------- / * Model Generated by TAIYO YUDEN Corporation (http://www.ty-top.com) / * Version 1.0 / * TAIYO YUDEN Control No. 170508_120810 / * Copyright(c) 2012 TAIYO YUDEN CO.,LTD. All Rights Reserved. / *-------------------------------------------------------------------------------------------------------- / * / * Products Name : Multilayer Ceramic Capacitors / * / * Characteristics : / *     Capacitance : 0.1 uF , Rated Voltage : 50V , TCC : X5R / *     Case Size : 1.0 x 0.5 / 0.039 x 0.02 [mm/inch] , Thickness : 0.5 / 0.02 [mm/inch] / *     (Conditions: Temperature = 25 degC , DC Bias Current/Voltage = 0A / 0V) / * / * Frequency Range : 40Hz - 3GHz / * / * External Node Assignments : / * / *  1  o---| |---o  2 / * / *-------------------------------------------------------------------------------------------------------- / .SubCkt UMK105BJ104_V-F 1 2 / **************************** / C0 1 110 0.068998u / Cm 1 101 0.01292u / C1 101 102 0.041907u / Rc1 101 102 25.432k / C2 102 103 0.021417u / Rc2 102 103 1.1926k / C3 103 110 0.016759u / Rc3 103 110 12.415 / C2m 1 301 0.022631u / C21 301 302 0.1608u / Rc21 301 302 202.11k / C22 302 303 0.054305u / Rc22 302 303 87.274k / C23 303 304 0.14296u / Rc23 303 304 7.7387k / C24 304 305 0.08092u / Rc24 304 305 2.9339k / C25 305 306 0.04951u / Rc25 305 306 2.1733k / C26 306 307 0.043691u / Rc26 306 307 191.91 / C27 307 308 0.016759u / Rc27 307 308 147.23 / C28 308 309 5027.4p / Rc28 308 309 97.746 / C29 309 110 570.66p / Rc29 309 110 12.365 / Rp0 1 110 5G / L0 110 120 0.23341n / Lm 120 130 0.14222n / L1 120 121 0.036554n / RL1 121 130 1.698 / L2 120 122 0.11188n / RL2 122 130 0.33926 / L3 120 123 1.1401n / RL3 123 130 1.655 / CR 120 124 0.028892u / LR 124 125 0.10347n / RR 125 130 0.14446 / CL 130 140 2.048p / LL 130 140 0.1545n / RL 130 140 189.66 / Rs 140 2 26.069m / **************************** / .ends UMK105BJ104_V-F</Text> / </Model> / </CacheFrame> / </root>
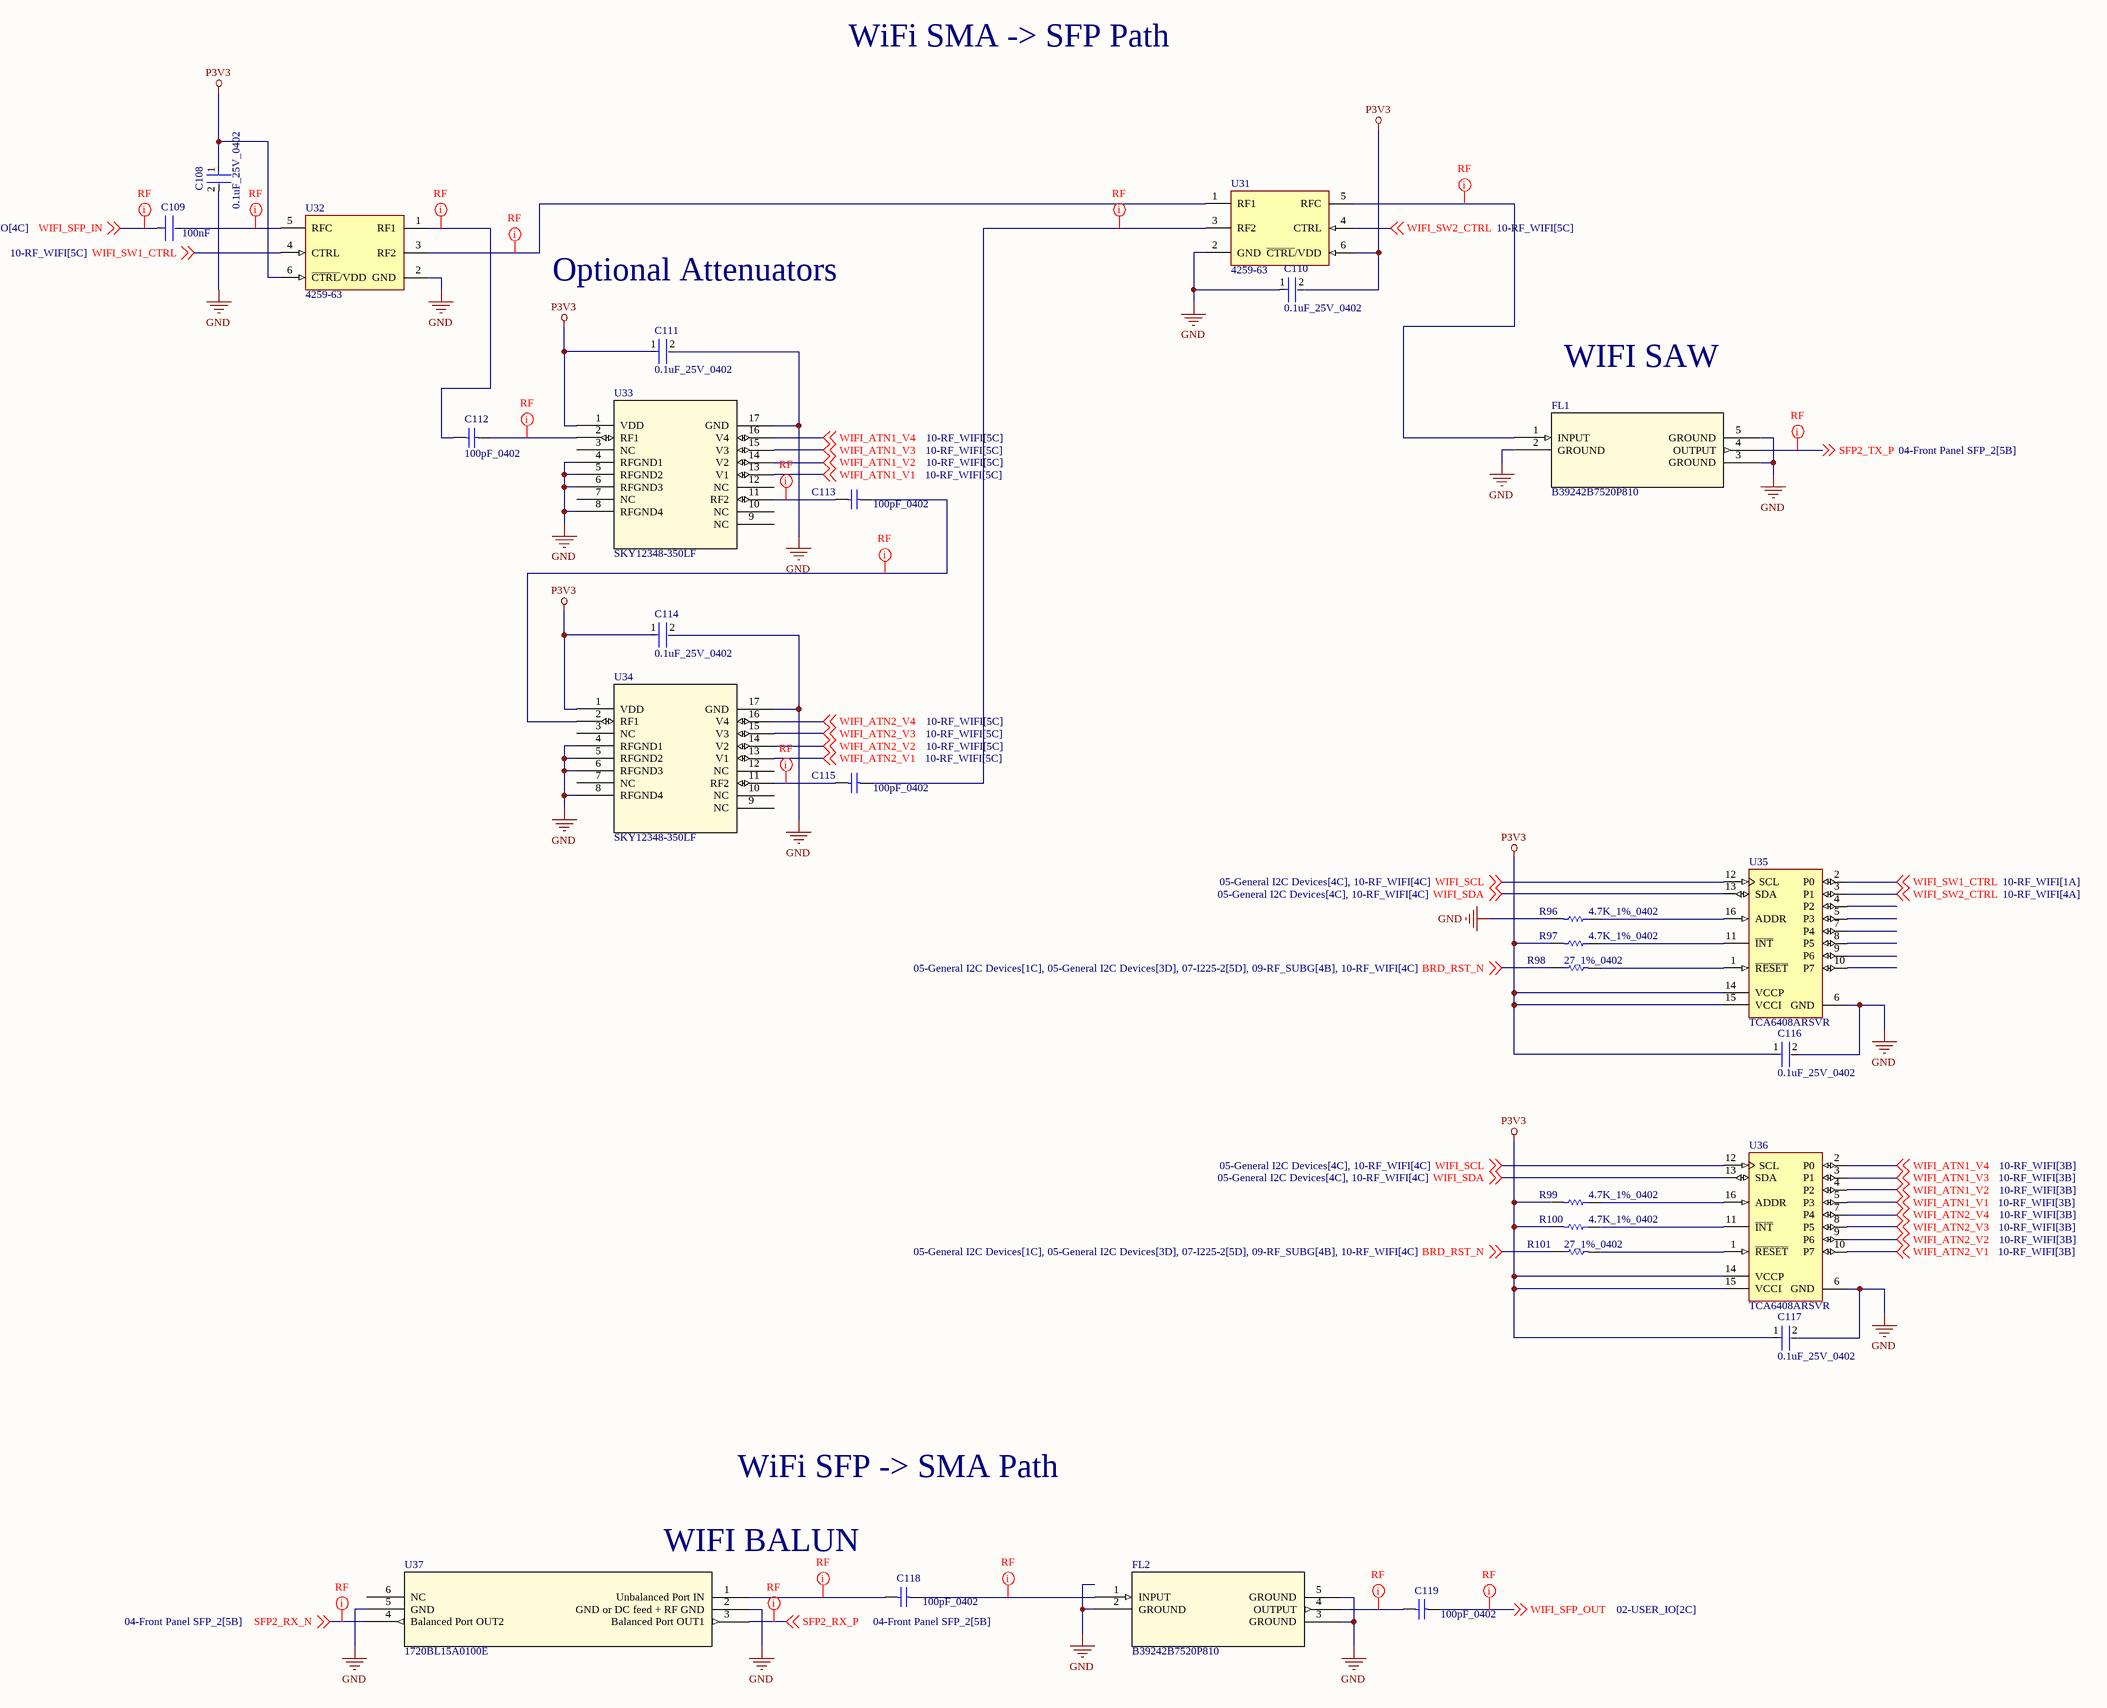
[diagram p7: 10-RF_WIFI.SchDoc]

### Parts
C108  0.1uF_25V_0402  [FP-0402-L_1_0_1-W_0_5_0_1-IPC_C]
C109  100nF  [FP-0402-L_1_0_0_05-W_0_5-IPC_B]
C110  0.1uF_25V_0402  [FP-0402-L_1_0_1-W_0_5_0_1-IPC_C]
C111  0.1uF_25V_0402  [FP-0402-L_1_0_1-W_0_5_0_1-IPC_C]
C112  100pF_0402  [CAPC1005X55X25ML05T10]
C113  100pF_0402  [CAPC1005X55X25ML05T10]
C114  0.1uF_25V_0402  [FP-0402-L_1_0_1-W_0_5_0_1-IPC_C]
C115  100pF_0402  [CAPC1005X55X25ML05T10]
C116  0.1uF_25V_0402  [FP-0402-L_1_0_1-W_0_5_0_1-IPC_C]
C117  0.1uF_25V_0402  [FP-0402-L_1_0_1-W_0_5_0_1-IPC_C]
C118  100pF_0402  [CAPC1005X55X25ML05T10]
C119  100pF_0402  [CAPC1005X55X25ML05T10]
FL1  B39242B7520P810  [SMD5_SAW-B7520_QUA]
FL2  B39242B7520P810  [SMD5_SAW-B7520_QUA]
R96  4.7K_1%_0402  [RESC1005X40X25NL10T10]
R97  4.7K_1%_0402  [RESC1005X40X25NL10T10]
R98  27_1%_0402  [RESC1005X40X25NL05T05]
R99  4.7K_1%_0402  [RESC1005X40X25NL10T10]
R100  4.7K_1%_0402  [RESC1005X40X25NL10T10]
R101  27_1%_0402  [RESC1005X40X25NL05T05]
U31  4259-63  [PERE-SC-70-6_M]
U32  4259-63  [PERE-SC-70-6_M]
U33  SKY12348-350LF  [SKY12348-350LF_SKY]
U34  SKY12348-350LF  [SKY12348-350LF_SKY]
U35  TCA6408ARSVR  [RSV0016A_V]
U36  TCA6408ARSVR  [RSV0016A_V]
U37  1720BL15A0100E  [SMT_15B0050E_JOT]

### Nets
GND: C108.2 C110.1 C111.2 C114.2 C116.2 C117.2 FL1.2(GROUND) FL1.3(GROUND) FL1.5(GROUND) FL2.2(GROUND) FL2.3(GROUND) FL2.5(GROUND) R96.2 U31.2(GND) U32.2(GND) U33.4(RFGND1) U33.5(RFGND2) U33.6(RFGND3) U33.8(RFGND4) U33.17(GND) U34.4(RFGND1) U34.5(RFGND2) U34.6(RFGND3) U34.8(RFGND4) U34.17(GND) U35.6(GND) U36.6(GND) U37.2(GND_or_DC_feed_+_RF_GND) U37.5(GND)
P3V3: C108.1 C110.2 C111.1 C114.1 C116.1 C117.1 R97.2 R99.2 R100.2 U31.6(~{CTRL}/VDD) U32.6(~{CTRL}/VDD) U33.1(VDD) U34.1(VDD) U35.14(VCCP) U35.15(VCCI) U36.14(VCCP) U36.15(VCCI)
BRD_RST_N: R98.1 R101.1 ; off-sheet BRD_RST_N
SFP2_RX_N: U37.4(Balanced_Port_OUT2) ; off-sheet SFP2_RX_N
SFP2_RX_P: U37.3(Balanced_Port_OUT1) ; off-sheet SFP2_RX_P
SFP2_TX_P: FL1.4(OUTPUT) ; off-sheet SFP2_TX_P
WIFI_ATN1_V1: U33.13(V1) U36.5(P3) ; off-sheet WIFI_ATN1_V1
WIFI_ATN1_V2: U33.14(V2) U36.4(P2) ; off-sheet WIFI_ATN1_V2
WIFI_ATN1_V3: U33.15(V3) U36.3(P1) ; off-sheet WIFI_ATN1_V3
WIFI_ATN1_V4: U33.16(V4) U36.2(P0) ; off-sheet WIFI_ATN1_V4
WIFI_ATN2_V1: U34.13(V1) U36.10(P7) ; off-sheet WIFI_ATN2_V1
WIFI_ATN2_V2: U34.14(V2) U36.9(P6) ; off-sheet WIFI_ATN2_V2
WIFI_ATN2_V3: U34.15(V3) U36.8(P5) ; off-sheet WIFI_ATN2_V3
WIFI_ATN2_V4: U34.16(V4) U36.7(P4) ; off-sheet WIFI_ATN2_V4
WIFI_SCL: U35.12(SCL) U36.12(SCL) ; off-sheet WIFI_SCL
WIFI_SDA: U35.13(SDA) U36.13(SDA) ; off-sheet WIFI_SDA
WIFI_SFP_IN: C109.1 ; off-sheet WIFI_SFP_IN
WIFI_SFP_OUT: C119.2 ; off-sheet WIFI_SFP_OUT
WIFI_SW1_CTRL: U32.4(CTRL) U35.2(P0) ; off-sheet WIFI_SW1_CTRL
WIFI_SW2_CTRL: U31.4(CTRL) U35.3(P1) ; off-sheet WIFI_SW2_CTRL
NetC109_2: C109.2 U32.5(RFC)
NetC112_1: C112.1 U32.1(RF1)
NetC112_2: C112.2 U33.2(RF1)
NetC113_1: C113.1 U33.11(RF2)
NetC113_2: C113.2 U34.2(RF1)
NetC115_1: C115.1 U34.11(RF2)
NetC115_2: C115.2 U31.3(RF2)
NetC118_1: C118.1 U37.1(Unbalanced_Port_IN)
NetC118_2: C118.2 FL2.1(INPUT)
NetC119_1: C119.1 FL2.4(OUTPUT)
NetFL1_1: FL1.1(INPUT) U31.5(RFC)
NetR96_1: R96.1 U35.16(ADDR)
NetR97_1: R97.1 U35.11(~{INT})
NetR98_2: R98.2 U35.1(~{RESET})
NetR99_1: R99.1 U36.16(ADDR)
NetR100_1: R100.1 U36.11(~{INT})
NetR101_2: R101.2 U36.1(~{RESET})
NetU31_1: U31.1(RF1) U32.3(RF2)

Not connected (* = marked no-connect by the designer): U33 3(NC) 7(NC) 9(NC) 10(NC) 12(NC); U34 3(NC) 7(NC) 9(NC) 10(NC) 12(NC); U35 4(P2) 5(P3) 7(P4) 8(P5) 9(P6) 10(P7); U37 6(NC)

### Layout directives
net class RF: NetC109_2, NetC112_1, NetC112_2, NetC113_1, NetC113_2, NetC115_1, NetC115_2, NetC118_1, NetC118_2, NetC119_1, NetFL1_1, NetU31_1, SFP2_RX_N, SFP2_RX_P, SFP2_TX_P, WIFI_SFP_IN, WIFI_SFP_OUT

### Notes on the sheet
- WiFi SMA -> SFP Path
- Optional Attenuators
- WIFI SAW
- WiFi SFP -> SMA Path
- (near U37) WIFI BALUN

### Library data of the parts
C108 C110 C111 C114 C116 C117 = CMP-2008-02519-2: as C19 on sheet 08-RF_GPS; Package Quantity: 1; Capacitance: 100nF; Min Operating Temperature: -55°C; Voltage: 25V; Voltage Rating: 25V; Construction: Flat; Max Operating Temperature: 125°C; Radiation Hardening: No; Depth: 0.5mm; Thickness: 0.022inch; Voltage Rating (DC): 25V; Number of Pins: 2; Lead Free: Lead Free; Series: -; REACH SVHC: No SVHC; Length: 1mm; Dielectric: X7R; RoHS Compliant: Yes; Mount: Surface Mount; Packaging: Tape and Reel; Case/Package: 0402; Case Code (Imperial): 0402; Termination: SMD/SMT; Width: 0.02inch; Case Code (Metric): 1005; Tolerance: 10%
C109 = CMP-14477-000330-2: as C26 on sheet 08-RF_GPS; RoHS Compliant: Yes; Termination: SMD/SMT; Packaging: Tape and Reel; Capacitance: 100nF; Height: 0.5mm; Halogen Free: Halogen Free; Case Code (Metric): 1005; Width: 0.02inch; Max Operating Temperature: 85°C; Voltage Rating: 50V; Min Operating Temperature: -55°C; Package Quantity: 10000; Case/Package: 0402; Case Code (Imperial): 0402; Length: 0.039inch; Thickness: 0.022inch; Mount: Surface Mount
C112 C113 C115 C118 C119 = CMP-2008-03915-1: as C89 on sheet 09-RF_SUBG
FL1 FL2 = B39242B7520P810: No Description Available; Mfr_Name: Qualcomm; Type: SAW Filters; RefDes: RefDes
R96 R97 R99 R100 = CMP-2002-05217-1: as R62 on sheet 09-RF_SUBG
R98 R101 = CMP-2002-08434-1: as R70 on sheet 09-RF_SUBG
U31 U32 = CMP-2000-05298-1: as U9 on sheet 08-RF_GPS; Series: UltraCMOS; Manufacturer URL: http://www.psemi.com/; Package Description: 6-Pin Small Outline Transistor, Body 2.05 x 1.25 mm, Pitch 0.65 mm; Family: RFSwitches; Packaging: Tape&Reel(TR); Features: Single/DualLineControl; Package / Case: 6-TSSOP,SC-88,SOT-363; Operating Temperature: -40degC~85degC; Circuit: SPDT; Supplier Device Package: SC-70-6; Standard Package: 3,000; Datasheet URL: https://datasheet.ciiva.com/15100/getdatasheetpartid-685660-15100501.pdf; Category: RF/IFandRFID; Datasheet Version: Jan-11; Package Reference: SC-70-6
U33 U34 = SKY12348-350LF: as U24 on sheet 09-RF_SUBG; RefDes: RefDes; Type: Type
U35 U36 = CMP-0314-00021-2: as U26 on sheet 09-RF_SUBG; Reset Input: Yes; ComponentLink2URL: http://www.ti.com/litv/pdf/mpqf115g; PackageVersion: revD, Dec-2011; No. of Outputs: 8; PackageReference: RSV0016A; DatasheetVersion: SCPS192C; fSCLK(Max)(MHz): 400; Mounting Technology: Surface Mount; ComponentLink1Description: Datasheet; Push-Pull I/O Type: Yes; Code_JEDEC: MO-288*; PackageDescription: 16-Leads Plastic Quad Flatpack No-Lead, 2.6 x 1.8 x 0.5 mm Body, 0.4 mm Pitch; ComponentLink1URL: http://www.ti.com/general/docs/lit/getliterature.tsp?genericPartNumber=TCA6408A&fileType=pdf; Interrupt Output: Yes; PartNumber: TCA6408ARSVR; Eco-Plan: Green (RoHS & no Sb/Br); Low Power: Yes; Vcc range(V): 1.65 to 5.5; ComponentLink2Description: Package Specification; 5V Tolerant I/O: Yes
U37 = 1720BL15A0100E: as U15 on sheet 08-RF_GPS; RefDes: RefDes; Type: Type

## Nets that join several sheets
GND: 02-USER_IO (30 pins), 04-Front Panel SFP_2 (44 pins), 05-General I2C Devices (12 pins), 06-I225-1 (11 pins), 07-I225-2 (37 pins), 08-RF_GPS (35 pins), 09-RF_SUBG (28 pins), 10-RF_WIFI (29 pins)
P0V95_I225: 06-I225-1 (7 pins), 07-I225-2 (11 pins)
P3V3: 02-USER_IO (6 pins), 04-Front Panel SFP_2 (15 pins), 05-General I2C Devices (25 pins), 06-I225-1 (15 pins), 07-I225-2 (23 pins), 08-RF_GPS (17 pins), 09-RF_SUBG (13 pins), 10-RF_WIFI (17 pins)
BRD_RST_N: 05-General I2C Devices (R60.1 R121.1), 07-I225-2 (R125.2 U17.3), 09-RF_SUBG (R70.1), 10-RF_WIFI (R98.1 R101.1)
GNSS_ANT: 02-USER_IO (D2.3 J13.1), 08-RF_GPS (C26.2 L2.2)
GNSS_LNA1_EN: 05-General I2C Devices (U1.2), 08-RF_GPS (U7.6)
GNSS_LNA2_EN: 05-General I2C Devices (U1.8), 08-RF_GPS (U18.6)
GNSS_SFP_OUT: 02-USER_IO (D5.3 J11.1), 08-RF_GPS (U20.5)
GNSS_SW1_CTRL: 05-General I2C Devices (U1.3), 08-RF_GPS (U11.4)
GNSS_SW2_CTRL: 05-General I2C Devices (U1.4), 08-RF_GPS (U9.4)
GNSS_SW3_CTRL: 05-General I2C Devices (U1.5), 08-RF_GPS (U16.4)
GNSS_SW4_CTRL: 05-General I2C Devices (U1.7), 08-RF_GPS (U19.4)
I225_CLKREQ_N: 06-I225-1 (U5.3), 07-I225-2 (R51.1)
I225_DISABLE_N: 06-I225-1 (U5.2), 07-I225-2 (R54.1 R55.2)
I225_JTAG_CLK: 06-I225-1 (U5.29), 07-I225-2 (R57.2)
I225_JTAG_RSTN: 06-I225-1 (U5.16), 07-I225-2 (R56.2)
I225_LAN_PWR_GOOD: 06-I225-1 (U5.1), 07-I225-2 (R53.1)
I225_ULP_WAKE_N: 06-I225-1 (U5.4), 07-I225-2 (R50.1)
I225_WAKE_N: 06-I225-1 (U5.12), 07-I225-2 (R52.1)
LED_LINK_ACT#: 06-I225-1 (U5.30), 07-I225-2 (R241.2)
LED_SPEED_1000#: 06-I225-1 (U5.32), 07-I225-2 (R240.2)
LED_SPEED_2500#: 06-I225-1 (U5.31), 07-I225-2 (U17.2)
MDI_A_N: 06-I225-1 (U5.46), 07-I225-2 (J10.3 U12.4)
MDI_A_P: 06-I225-1 (U5.45), 07-I225-2 (J10.1 U12.5)
MDI_B_N: 06-I225-1 (U5.49), 07-I225-2 (J10.6 U12.2)
MDI_B_P: 06-I225-1 (U5.48), 07-I225-2 (J10.4 U12.1)
MDI_C_N: 06-I225-1 (U5.52), 07-I225-2 (J10.9 U14.4)
MDI_C_P: 06-I225-1 (U5.51), 07-I225-2 (J10.7 U14.5)
MDI_D_N: 06-I225-1 (U5.55), 07-I225-2 (J10.12 U14.2)
MDI_D_P: 06-I225-1 (U5.54), 07-I225-2 (J10.10 U14.1)
PCIE_PERST: 05-General I2C Devices (P1.2), 06-I225-1 (U5.13), 07-I225-2 (R125.1 U17.1)
SCL: 05-General I2C Devices (P1.3 R124.1 U13.22), 06-I225-1 (R43.1)
SDA: 05-General I2C Devices (P1.4 R123.1 U13.23), 06-I225-1 (R42.1)
SFP2_RX_N: 04-Front Panel SFP_2 (J16.12 R89.1), 10-RF_WIFI (U37.4)
SFP2_RX_P: 04-Front Panel SFP_2 (J16.13 R88.1), 10-RF_WIFI (U37.3)
SFP2_TX_P: 04-Front Panel SFP_2 (J16.18 R79.1), 10-RF_WIFI (FL1.4)
SFP3_SCL: 04-Front Panel SFP_2 (J16.5 R74.2), 05-General I2C Devices (U13.16)
SFP3_SDA: 04-Front Panel SFP_2 (J16.4 R73.2), 05-General I2C Devices (U13.15)
SUBG_SCL: 05-General I2C Devices (R120.1 U13.11), 09-RF_SUBG (U26.12)
SUBG_SDA: 05-General I2C Devices (R119.1 U13.10), 09-RF_SUBG (U26.13)
SUBG_SFP_IN: 02-USER_IO (D1.3 J8.1), 09-RF_SUBG (C86.1)
SUBG_SFP_OUT: 02-USER_IO (D4.3 J12.1), 09-RF_SUBG (C95.2)
SUBG_SW1_CTRL: 05-General I2C Devices (U1.9), 09-RF_SUBG (U23.4)
SUBG_SW2_CTRL: 05-General I2C Devices (U1.10), 09-RF_SUBG (U22.4)
WIFI_SCL: 05-General I2C Devices (R35.1 U13.14), 10-RF_WIFI (U35.12 U36.12)
WIFI_SDA: 05-General I2C Devices (R36.1 U13.13), 10-RF_WIFI (U35.13 U36.13)
WIFI_SFP_IN: 02-USER_IO (D6.3 J14.1), 10-RF_WIFI (C109.1)
WIFI_SFP_OUT: 02-USER_IO (D3.3 J7.1), 10-RF_WIFI (C119.2)